# Altium schematic sheet Connectors.SchDoc
size A; SheetNumber: 3; SheetTotal: 3
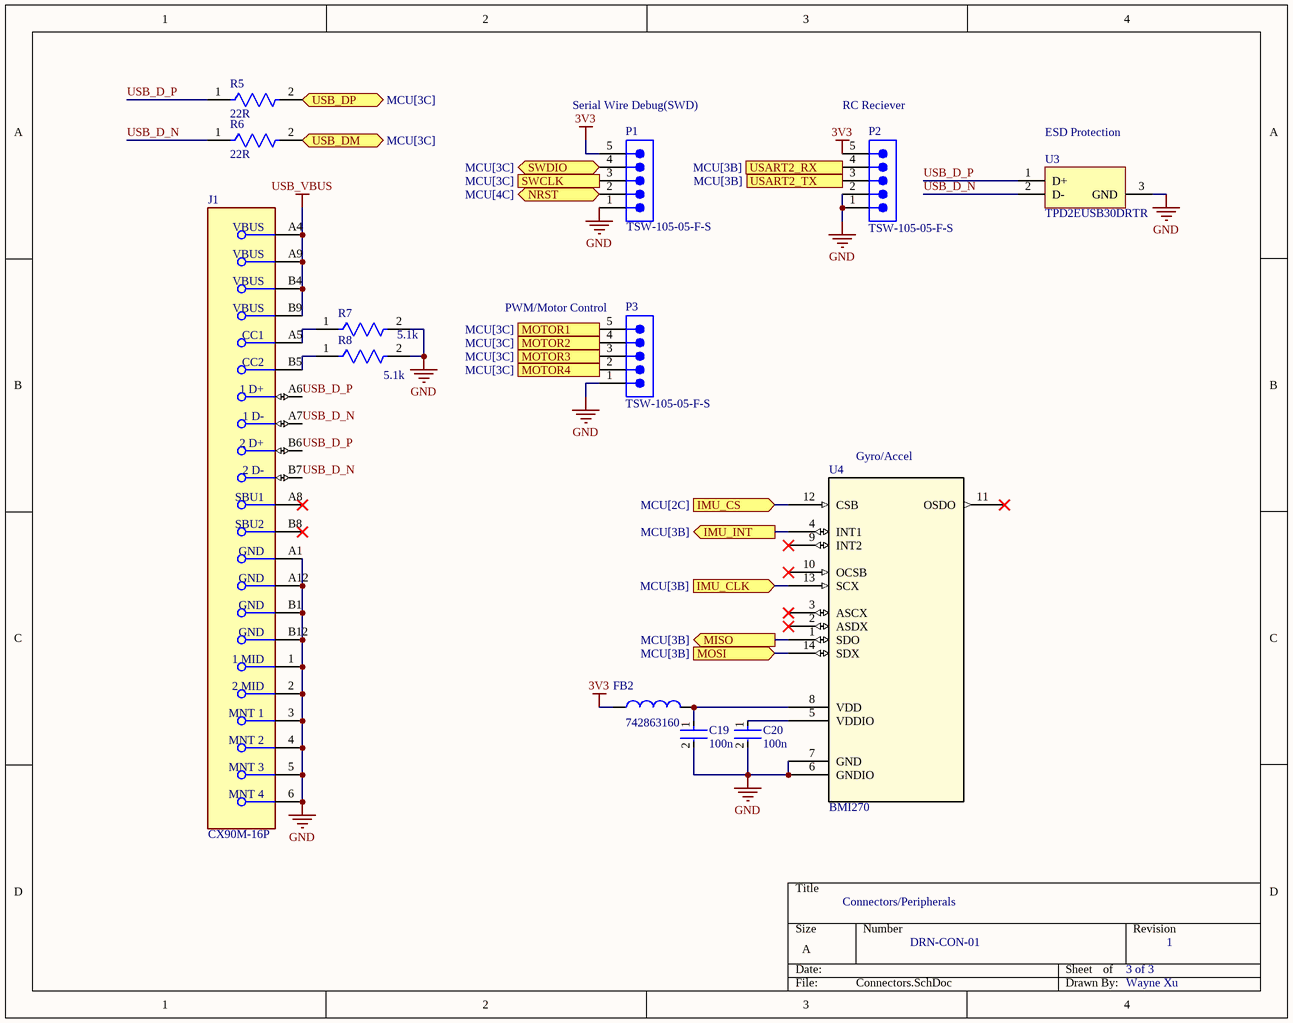
[diagram p0: Connectors.SchDoc]

## Parts
C19  100n  [FP-C0603C-CF-MFG]
C20  100n  [FP-C0603C-CF-MFG]
FB2  742863160  [WE-CBF HF_0603_HC]
J1  CX90M-16P  [FP-CX90M-16P-MFG]
P1  TSW-105-05-F-S  [SMTC-TSW-105-05-X-S]
P2  TSW-105-05-F-S  [SMTC-TSW-105-05-X-S]
P3  TSW-105-05-F-S  [SMTC-TSW-105-05-X-S]
R5  22R  [FP-CRGCQ0603-IPC_C]
R6  22R  [FP-CRGCQ0603-IPC_C]
R7  5.1k  [FP-RN73R1E-IPC_C]
R8  5.1k  [FP-RN73R1E-IPC_C]
U3  TPD2EUSB30DRTR  [DRT0003A]
U4  BMI270  [BMI270_BOS]

## Ports
IMU_CLK (in, see MCU[3B]), IMU_CS (in, see MCU[2C]), IMU_INT (out, see MCU[3B]), MISO (out, see MCU[3B]), MOSI (in, see MCU[3B]), MOTOR1 (in, see MCU[3C]), MOTOR2 (in, see MCU[3C]), MOTOR3 (in, see MCU[3C]), MOTOR4 (in, see MCU[3C]), NRST (bidir, see MCU[4C]), SWCLK (out, see MCU[3C]), SWDIO (bidir, see MCU[3C]), USART2_RX (out, see MCU[3B]), USART2_TX (in, see MCU[3B]), USB_DM (bidir, see MCU[3C]), USB_DP (bidir, see MCU[3C])

## Nets
3V3: FB2.1 P1.5 P2.5
GND: C19.2 C20.2 J1.1(1_MID) J1.2(2_MID) J1.3(MNT_1) J1.4(MNT_2) J1.5(MNT_3) J1.6(MNT_4) J1.A1(GND) J1.A12(GND) J1.B1(GND) J1.B12(GND) P1.1 P2.1 P2.2 P3.1 R7.2 R8.2 U3.3(GND) U4.6(GNDIO) U4.7(GND)
USB_VBUS: J1.A4(VBUS) J1.A9(VBUS) J1.B4(VBUS) J1.B9(VBUS)
IMU_CLK: U4.13(SCX) ; port IMU_CLK
IMU_CS: U4.12(CSB) ; port IMU_CS
IMU_INT: U4.4(INT1) ; port IMU_INT
MISO: U4.1(SDO) ; port MISO
MOSI: U4.14(SDX) ; port MOSI
MOTOR1: P3.5 ; port MOTOR1
MOTOR2: P3.4 ; port MOTOR2
MOTOR3: P3.3 ; port MOTOR3
MOTOR4: P3.2 ; port MOTOR4
NRST: P1.2 ; port NRST
SWCLK: P1.3 ; port SWCLK
SWDIO: P1.4 ; port SWDIO
USART2_RX: P2.4 ; port USART2_RX
USART2_TX: P2.3 ; port USART2_TX
USB_D_N: J1.A7(1_D-) J1.B7(2_D-) R6.1 U3.2(D-)
USB_D_P: J1.A6(1_D+) J1.B6(2_D+) R5.1 U3.1(D+)
USB_DM: R6.2 ; port USB_DM
USB_DP: R5.2 ; port USB_DP
NetC19_1: C19.1 FB2.2 U4.8(VDD)
NetC20_1: C20.1 U4.5(VDDIO)
NetJ1_A5: J1.A5(CC1) R7.1
NetJ1_B5: J1.B5(CC2) R8.1

Not connected (* = marked no-connect by the designer): J1 A8(SBU1)* B8(SBU2)*; U4 2(ASDX)* 3(ASCX)* 9(INT2)* 10(OCSB)* 11(OSDO)*

## Notes on the sheet
- (near P1) Serial Wire Debug(SWD)
- (near P2) RC Reciever
- (near U3) ESD Protection
- (near P3) PWM/Motor Control
- (near U4) Gyro/Accel
- Connectors/Peripherals
- DRN-CON-01
- 3 of 3
- 1
- Wayne Xu

## Library data of the parts
C19 C20 = CMP-2006-03066-2: CAP CER 0.1UF 25V Y5V 0603; Manufacturer Part Number: C0603C104M3VACTU; Manufacturer: KEMET; Capacitance: 0.10 μF; Material: Ceramic; Temperature Coefficient: 30ppm/°C; Value: 0.10 μF; Automotive Grade: Grade 1; Tolerance: 0.2; Height: 0.87mm; Category: Cap; ComponentLink2Description: Datasheet; Temperature Range High: +125°C; Automotive: Yes; ComponentLink2URL: https://api.kemet.com/component-edge/download/datasheet/C0603C100J5GACAUTO.pdf; Mouser Description: Multilayer Ceramic Capacitors MLCC - SMD/SMT 25volts 0.1uF Y5V 20%; Device Class L2: Capacitors; Device Class L3: Ceramic Capacitors; Temperature: -55°C to +125°C; Lead Free: Yes; Temperature Range Low: -55°C; Package: C0603C-CF; RoHS: TRUE; Temperature Characteristic: Y5V; Octopart: https://octopart.com/c0603c104m3vactu-kemet-149363; Digikey Description: CAP CER 0.1UF 25V Y5V 0603; Voltage Rating: 25 V; Device Class L1: Passive Components
FB2 = CMP-0220-00101-3: Ferrite Bead (emi Suppression), 1.6X0.8X0.8MM (0603), 600O Impedance At 100 Mhz; Current Rating: 400mA; DC Resistance (DCR): 220mΩ; Max Current Rating: 500mA; Impedance: 600Ω; Tolerance: 25%; Resistance: 350mΩ; Number of Lines: 1; Test Frequency: 100MHz; Height: 800µm; Min Operating Temperature: -55°C; Length: 1.6mm; Width: 800µm; Case Code (Imperial): 0603; Depth: 800µm; Number of Pins: 2; Case Code (Metric): 1608; Case/Package: SMD/SMT; Lead Free: Lead Free; Core Material: Ferrite; Max Operating Temperature: 125°C; Termination: SMD/SMT; RoHS: Compliant; REACH SVHC: Unknown; Max DC Current: 500mA; Mount: Surface Mount
J1 = CMP-11601-000005-1: CONN RCPT USB2.0 TYPEC 16POS SMD; Connector Type: USB; Current Rating: 1.25A; Mating Cycles: 10000; Number of Contacts: 16; Gender: Receptacle; Shielding: Shielded; Number of Ports: 1; Insulation Color: Black; Termination: Solder; Min Operating Temperature: -30°C; Flammability Rating: UL94 V-0; Max Operating Temperature: 85°C; Packaging: Cut Tape; Contact Plating: Gold; Mount: Surface Mount
P1-P3 = CMP-1024-00365-1: 0.025" SQ Post Header, Through-hole, Vertical, -55 to 125 degC, 2.54 mm Pitch, 5-Pin, Male, RoHS; Manufacturer: Samtec; Pitch: 2.54 mm; PackageReference: TSW-105-05-X-S; ComponentLink1Description: Manufacturer URL; Temperature Range: -55 to 125 degC; ComponentLink2Description: Datasheet; ComponentLink2URL: http://www.samtec.com/documents/webfiles/pdf/TSW_TH.PDF; PartNumber: TSW-105-05-F-S; ComponentLink3URL: http://www.samtec.com/documents/webfiles/cpdf/TSW-XXX-XX-XXX-X-XX-XXX-MKT.pdf; ComponentLink1URL: http://www.samtec.com; DatasheetVersion: F-214; Mounting Technology: Through-hole; RoHS: True; PackageVersion: DM, 8/1988; ComponentLink3Description: Package Specification; PackageDescription: .025[0.64] SQ. Post Terminal Strip Assembly; Orientation: Vertical
R5 R6 = CMP-03211-006549-1: CRGCQ 0603 22R 1%; Manufacturer: TE Connectivity; Manufacturer Part Number: CRGCQ0603F22R; Voltage Rating: 75V; Power Rating: 0.1W; Value: 22Ω; Tolerance: 0.01; Temperature Coefficient: ±200ppm/°C; Category: Res; Lead Free: Yes; Device Class L3: Chip SMD Resistors; Ipc Land Pattern Name: RESC16080X45; Temperature Range Low: -55°C; RoHS: TRUE; Height: 0.55mm; Temperature Range High: +155°C; Composition: Thick Film; Octopart: https://octopart.com/crgcq0603f22r-te+connectivity-91018058; Device Class L1: Passive Components; Temperature: -55°C to +155°C; Device Class L2: Resistors; Series: CRGCQ; Mouser Description: SMD AEC-Q200 Compliant Thick Film Chip Resistor; Digikey Description: CRGCQ 0603 22R 1%; Ambient Temperature Range High: +70°C; ComponentLink2Description: Datasheet; Package: CRGCQ0603; ComponentLink2URL: https://www.te.com/commerce/DocumentDelivery/DDEController?Action=showdoc&DocId=Data+Sheet%7F1773204-3%7F1%7Fpdf%7FEnglish%7FENG_DS_1773204-3_1.pdf%7F4-2176339-310; Resistance: 22Ω
R7 R8 = CMP-04015-008529-1: 5.1kΩ ±1% 0.063W, 1/16W Chip Resistor 0402 (1005 Metric) Moisture Resistant Thin Film
U3 = CMP-0326-00046-3: ESD Solution for Super-Speed (6 Gbps) USB 3.0 Interface, 2 Channels, -40 to +85 degC, 3-pin SOT (DRT), Green (Rohs & No Sb/Br); Manufacturer: Texas Instruments; Differential Capacitance(pF): 0.01; Breakdown Voltage(Min)(V): 9; HDMI: TRUE; IEC 61000-4-2 Air-Gap(+/- kV): 8; IO Leakage Current(nA): 10; IO Capacitance(Typ)(pF): 0.7; Mounting Technology: Surface Mount; PackageDescription: 3-Flat Lead Plastic Small Outline, 1 x 1 mm (inc leads), 0.35 mm Pitch; IEC 61000-4-2 Contact(+/- kV): 8; USB Super Speed: TRUE; Eco-Plan: Green (RoHS & no Sb/Br); USB High Speed: TRUE; PackageReference: DRT0003A; SubFamily: ESD Solution; USB Full Speed: TRUE; ComponentLink1Description: Datasheet; ComponentLink2URL: SamplesURL:http://www.ti.com/product/tpd2eusb30#samples; PackageVersion: revD, Jun-2008; ComponentLink2Description: URL Link1; 1394 / Firewire: TRUE; PartNumber: TPD2EUSB30DRTR; ComponentLink1URL: http://www.ti.com/general/docs/lit/getliterature.tsp?genericPartNumber=TPD2EUSB30&fileType=pdf; DatasheetVersion: SLVSAC2C; Serial ATA / eSATA: TRUE
U4 = BMI270: Description; Manufacturer_Name: Bosch Sensortec; Copyright: Copyright (C) 2025 Ultra Librarian. All rights reserved.; Manufacturer_Part_Number: BMI270; RefDes: RefDes; Type: Type